# EAGLE design PCB (EAGLE 9.6.2)
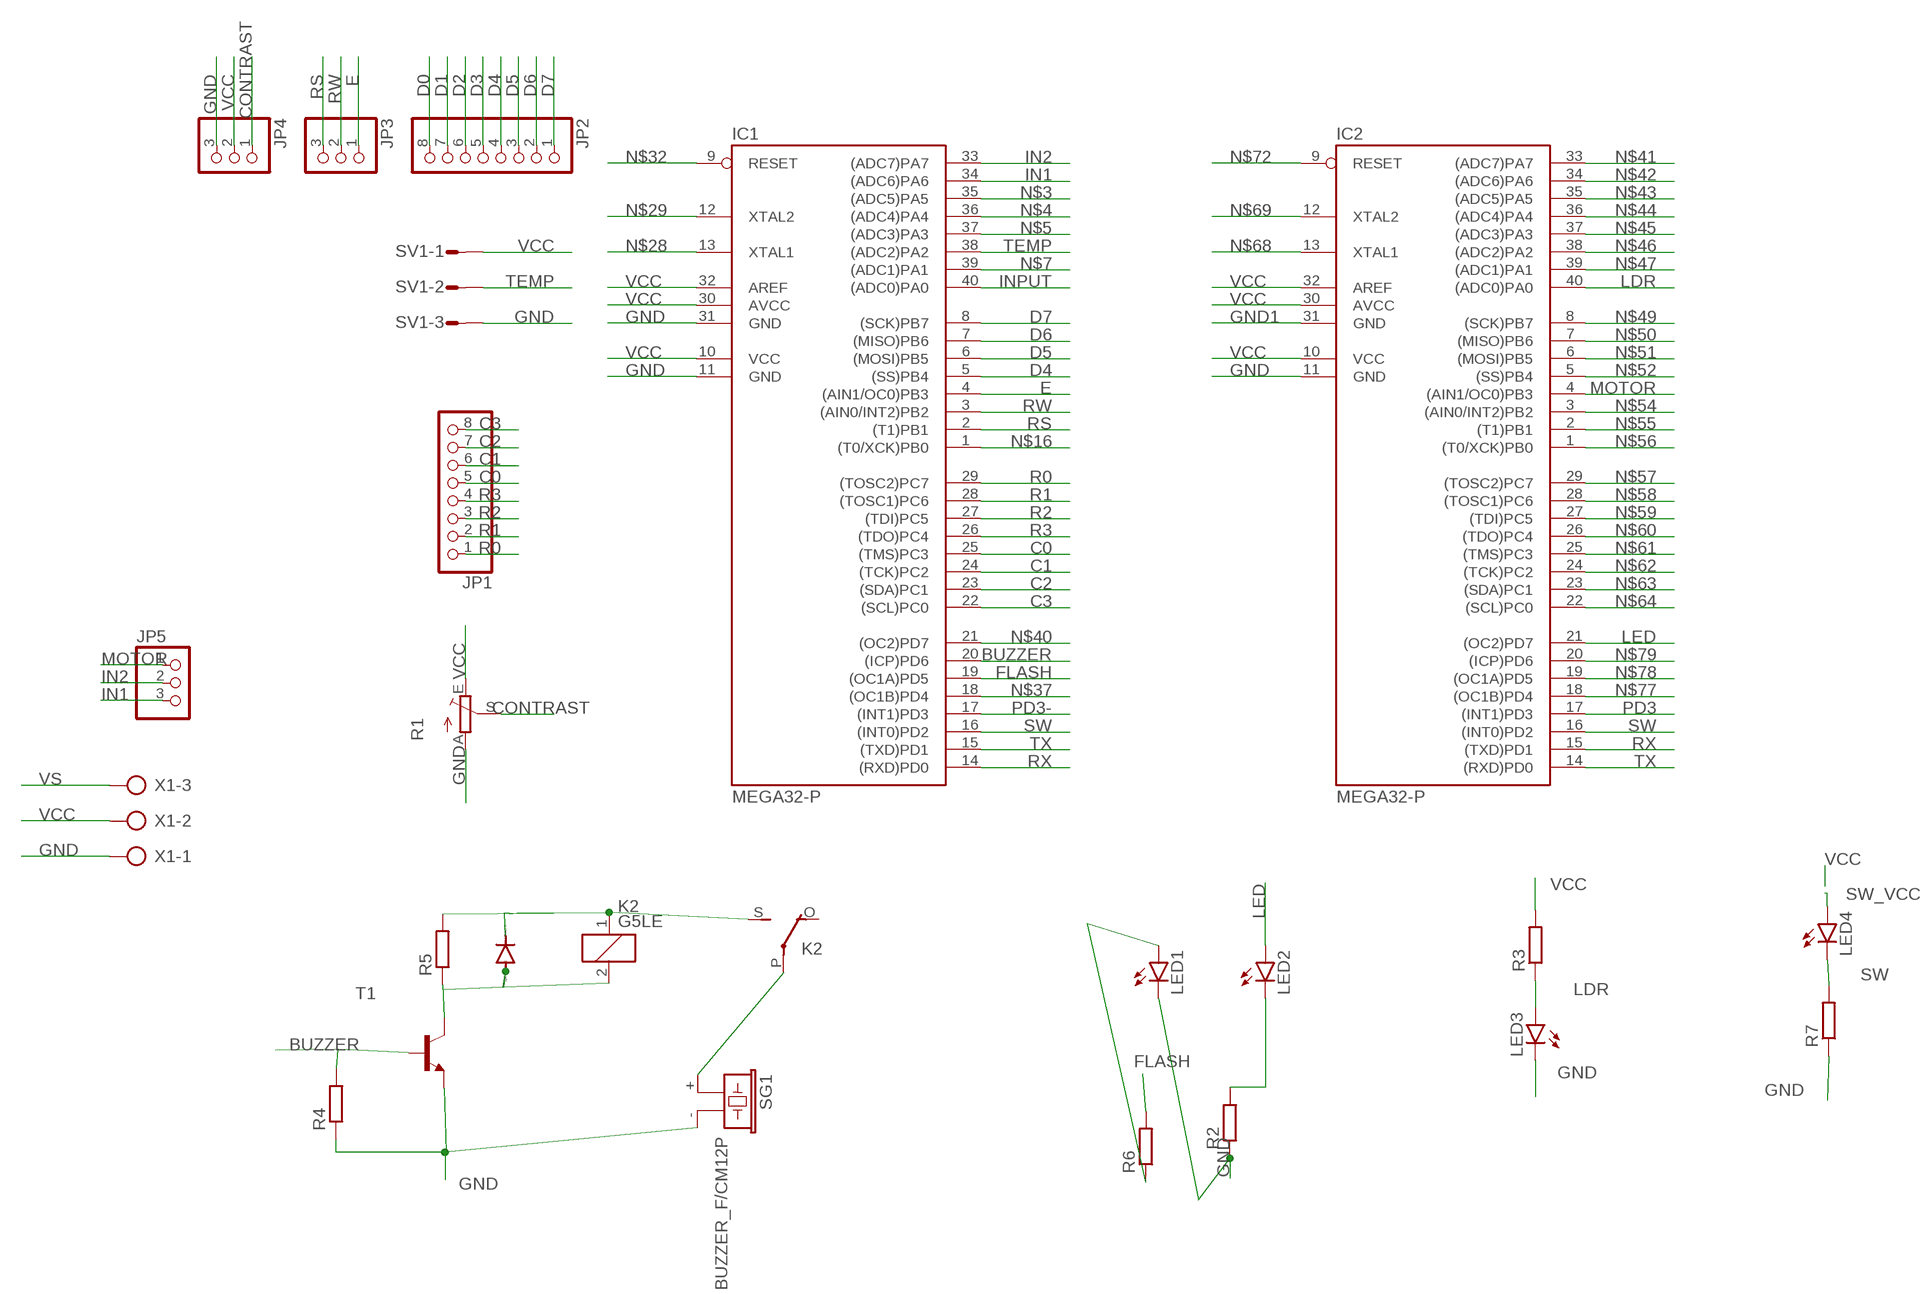
[diagram p0: schematic, sheet 1]

## Parts
D1  1N4004  [DO41-10]
IC1  MEGA32-P  [DIL40]
IC2  MEGA32-P  [DIL40]
JP1  PINHD-1X8  [1X08]
JP2  PINHD-1X8  [1X08]
JP3  PINHD-1X3  [1X03]
JP4  PINHD-1X3  [1X03]
JP5  PINHD-1X3  [1X03]
K2  G5LE  [G5LE]
LED1  LED3MM  [LED3MM]
LED2  LED3MM  [LED3MM]
LED3  LED5MM  [LED5MM]
LED4  LED5MM  [LED5MM]
R1  TRIM_EU-RJ9W  [RJ9W]
R2  R-EU_0204/7  [0204/7]
R3  R-EU_0204/7  [0204/7]
R4  R-EU_0204/7  [0204/7]
R5  R-EU_0204/7  [0204/7]
R6  R-EU_0204/7  [0204/7]
R7  R-EU_0204/7  [0204/7]
SG1  BUZZER_F/CM12P  [BUZZER_F/CM12P]
SV1  CON-AMP-MT_S03P  [CON-AMP-MT_S03P]
T1  2N2222-NPN-TO92-EBC  [TO92-EBC]
X1  AK300/3  [AK300/3]

## Nets
BUZZER: IC1.20((ICP)PD6)
C0: IC1.25((TMS)PC3) JP1.5
C1: IC1.24((TCK)PC2) JP1.6
C2: IC1.23((SDA)PC1) JP1.7
C3: IC1.22((SCL)PC0) JP1.8
CONTRAST: JP4.1 R1.S
D0: JP2.8
D1: JP2.7
D2: JP2.6
D3: JP2.5
D4: IC1.5((SS)PB4) JP2.4
D5: IC1.6((MOSI)PB5) JP2.3
D6: IC1.7((MISO)PB6) JP2.2
D7: IC1.8((SCK)PB7) JP2.1
E: IC1.4((AIN1/OC0)PB3) JP3.1
FLASH: IC1.19((OC1A)PD5) R6.2
GND: IC1.11(GND) IC1.31(GND) IC2.11(GND) JP4.3 LED1.K(C) LED3.K(C) R1.A R2.1 R4.1 R7.1 SG1.- SV1.3 T1.E X1.1
GND1: IC2.31(GND)
IN1: IC1.34((ADC6)PA6) JP5.3
IN2: IC1.33((ADC7)PA7) JP5.2
INPUT: IC1.40((ADC0)PA0)
LDR: IC2.40((ADC0)PA0) LED3.A R3.1
LED: IC2.21((OC2)PD7) LED2.A
MOTOR: IC2.4((AIN1/OC0)PB3) JP5.1
N$2: D1.C K2.1 K2.S(2:S) R5.2
N$3: IC1.35((ADC5)PA5)
N$4: IC1.36((ADC4)PA4)
N$5: IC1.37((ADC3)PA3)
N$6: LED2.K(C) R2.2
N$7: IC1.39((ADC1)PA1)
N$8: LED1.A R6.1
N$9: D1.A K2.2
N$10: R5.1 T1.C
N$11: R4.2 T1.B
N$12: K2.P(2:P) SG1.+
N$16: IC1.1((T0/XCK)PB0)
N$28: IC1.13(XTAL1)
N$29: IC1.12(XTAL2)
N$32: IC1.9(RESET)
N$37: IC1.18((OC1B)PD4)
N$40: IC1.21((OC2)PD7)
N$41: IC2.33((ADC7)PA7)
N$42: IC2.34((ADC6)PA6)
N$43: IC2.35((ADC5)PA5)
N$44: IC2.36((ADC4)PA4)
N$45: IC2.37((ADC3)PA3)
N$46: IC2.38((ADC2)PA2)
N$47: IC2.39((ADC1)PA1)
N$49: IC2.8((SCK)PB7)
N$50: IC2.7((MISO)PB6)
N$51: IC2.6((MOSI)PB5)
N$52: IC2.5((SS)PB4)
N$54: IC2.3((AIN0/INT2)PB2)
N$55: IC2.2((T1)PB1)
N$56: IC2.1((T0/XCK)PB0)
N$57: IC2.29((TOSC2)PC7)
N$58: IC2.28((TOSC1)PC6)
N$59: IC2.27((TDI)PC5)
N$60: IC2.26((TDO)PC4)
N$61: IC2.25((TMS)PC3)
N$62: IC2.24((TCK)PC2)
N$63: IC2.23((SDA)PC1)
N$64: IC2.22((SCL)PC0)
N$68: IC2.13(XTAL1)
N$69: IC2.12(XTAL2)
N$72: IC2.9(RESET)
N$77: IC2.18((OC1B)PD4)
N$78: IC2.19((OC1A)PD5)
N$79: IC2.20((ICP)PD6)
PD3: IC2.17((INT1)PD3)
PD3-: IC1.17((INT1)PD3)
R0: IC1.29((TOSC2)PC7) JP1.1
R1: IC1.28((TOSC1)PC6) JP1.2
R2: IC1.27((TDI)PC5) JP1.3
R3: IC1.26((TDO)PC4) JP1.4
RS: IC1.2((T1)PB1) JP3.3
RW: IC1.3((AIN0/INT2)PB2) JP3.2
RX: IC1.14((RXD)PD0) IC2.15((TXD)PD1)
SW: IC1.16((INT0)PD2) IC2.16((INT0)PD2) LED4.K(C) R7.2
SW_VCC: LED4.A
TEMP: IC1.38((ADC2)PA2) SV1.2
TX: IC1.15((TXD)PD1) IC2.14((RXD)PD0)
VCC: IC1.10(VCC) IC1.30(AVCC) IC1.32(AREF) IC2.10(VCC) IC2.30(AVCC) IC2.32(AREF) JP4.2 R1.E R3.2 SV1.1 X1.2
VS: X1.3
Unconnected: K2.O(2:O)

## Library data of the parts
D1 = diode:1N4004: DIODE general purpose rectifier, 1 A
IC1 IC2 = atmel:MEGA32-P: MICROCONTROLLER 32 Kbytes FLASH 2 Kbytes SRAM 1 Kbytes EEPROM USART 8-channel 10 bit ADC Source: www.atmel.com .. doc2503.pdf; MPN: ATMEGA32-16PU; OC_FARNELL: 1661729; OC_NEWARK: 51P1794
JP1 JP2 = MindCloud:PINHD-1X8: PIN HEADER
JP3-JP5 = MindCloud:PINHD-1X3: PIN HEADER
K2 = relay:G5LE: RELAY 1 x switch, 10 A/120 V AC, 8 A/30 V DC, Omron; OC_FARNELL: unknown; OC_NEWARK: unknown
LED1 LED2 = led:LED: LED OSRAM: - CHIPLED LG R971, LG N971, LY N971, LG Q971, LY Q971, LO R971, LY R971 LH N974, LH R974 LS Q976, LO Q976, LY Q976 LO Q996 - Hyper CHIPLED LW Q18S LB Q993, LB Q99A, LB R99A - SideLED LS A670, LO A670, LY A670, LG A670, LP A670 LB A673, LV A673, LT A673, LW A673 LH A674 LY A675 LS A676, LA A676, LO A676, LY A676, LW A676 LS A679, LY A679, LG A679 - Hyper Micro SIDELED® LS Y876, LA Y876, LO Y876, LY Y876 LT Y87S - SmartLED LW L88C, LW L88S LB L89C, LB L89S, LG L890 LS L89K, LO L89K, LY L89K LS L896, LA L896, LO L896, LY L896 - TOPLED LS T670, LO T670, LY T670, LG T670, LP T670 LSG T670, LSP T670, LSY T670, LOP T670, LYG T670 LG T671, LOG T671, LSG T671 LB T673, LV T673, LT T673, LW T673 LH T674 LS T676, LA T676, LO T676, LY T676, LB T676, LH T676, LSB T676, LW T676 LB T67C, LV T67C, LT T67C, LS T67K, LO T67K, LY T67K, LW E67C LS E67B, LA E67B, LO E67B, LY E67B, LB E67C, LV E67C, LT E67C LW T67C LS T679, LY T679, LG T679 LS T770, LO T770, LY T770, LG T770, LP T770 LB T773, LV T773, LT T773, LW T773 LH T774 LS E675, LA E675, LY E675, LS T675 LS T776, LA T776, LO T776, LY T776, LB T776 LHGB T686 LT T68C, LB T68C - Hyper Mini TOPLED® LB M676 - Mini TOPLED Santana® LG M470 LS M47K, LO M47K, LY M47K Source: http://www.osram.convergy.de LUXEON: - LUMILED® LXK2-PW12-R00, LXK2-PW12-S00, LXK2-PW14-U00, LXK2-PW14-V00 LXK2-PM12-R00, LXK2-PM12-S00, LXK2-PM14-U00 LXK2-PE12-Q00, LXK2-PE12-R00, LXK2-PE12-S00, LXK2-PE14-T00, LXK2-PE14-U00 LXK2-PB12-K00, LXK2-PB12-L00, LXK2-PB12-M00, LXK2-PB14-N00, LXK2-PB14-P00, LXK2-PB14-Q00 LXK2-PR12-L00, LXK2-PR12-M00, LXK2-PR14-Q00, LXK2-PR14-R00 LXK2-PD12-Q00, LXK2-PD12-R00, LXK2-PD12-S00 LXK2-PH12-R00, LXK2-PH12-S00 LXK2-PL12-P00, LXK2-PL12-Q00, LXK2-PL12-R00 Source: www.luxeon.com KINGBRIGHT: KA-3528ASYC Source: www.kingbright.com
LED3 LED4 = Test:LED: LED OSRAM: - CHIPLED LG R971, LG N971, LY N971, LG Q971, LY Q971, LO R971, LY R971 LH N974, LH R974 LS Q976, LO Q976, LY Q976 LO Q996 - Hyper CHIPLED LW Q18S LB Q993, LB Q99A, LB R99A - SideLED LS A670, LO A670, LY A670, LG A670, LP A670 LB A673, LV A673, LT A673, LW A673 LH A674 LY A675 LS A676, LA A676, LO A676, LY A676, LW A676 LS A679, LY A679, LG A679 - Hyper Micro SIDELED® LS Y876, LA Y876, LO Y876, LY Y876 LT Y87S - SmartLED LW L88C, LW L88S LB L89C, LB L89S, LG L890 LS L89K, LO L89K, LY L89K LS L896, LA L896, LO L896, LY L896 - TOPLED LS T670, LO T670, LY T670, LG T670, LP T670 LSG T670, LSP T670, LSY T670, LOP T670, LYG T670 LG T671, LOG T671, LSG T671 LB T673, LV T673, LT T673, LW T673 LH T674 LS T676, LA T676, LO T676, LY T676, LB T676, LH T676, LSB T676, LW T676 LB T67C, LV T67C, LT T67C, LS T67K, LO T67K, LY T67K, LW E67C LS E67B, LA E67B, LO E67B, LY E67B, LB E67C, LV E67C, LT E67C LW T67C LS T679, LY T679, LG T679 LS T770, LO T770, LY T770, LG T770, LP T770 LB T773, LV T773, LT T773, LW T773 LH T774 LS E675, LA E675, LY E675, LS T675 LS T776, LA T776, LO T776, LY T776, LB T776 LHGB T686 LT T68C, LB T68C - Hyper Mini TOPLED® LB M676 - Mini TOPLED Santana® LG M470 LS M47K, LO M47K, LY M47K Source: http://www.osram.convergy.de LUXEON: - LUMILED® LXK2-PW12-R00, LXK2-PW12-S00, LXK2-PW14-U00, LXK2-PW14-V00 LXK2-PM12-R00, LXK2-PM12-S00, LXK2-PM14-U00 LXK2-PE12-Q00, LXK2-PE12-R00, LXK2-PE12-S00, LXK2-PE14-T00, LXK2-PE14-U00 LXK2-PB12-K00, LXK2-PB12-L00, LXK2-PB12-M00, LXK2-PB14-N00, LXK2-PB14-P00, LXK2-PB14-Q00 LXK2-PR12-L00, LXK2-PR12-M00, LXK2-PR14-Q00, LXK2-PR14-R00 LXK2-PD12-Q00, LXK2-PD12-R00, LXK2-PD12-S00 LXK2-PH12-R00, LXK2-PH12-S00 LXK2-PL12-P00, LXK2-PL12-Q00, LXK2-PL12-R00 Source: www.luxeon.com KINGBRIGHT: KA-3528ASYC Source: www.kingbright.com
R1 = pot:TRIM_EU-: POTENTIOMETER
R2-R7 = rcl:R-EU_: RESISTOR, European symbol; SPICEPREFIX: R
SG1 = MindCloud:BUZZER_F/CM12P: BUZZER Source: Buerklin; OC_FARNELL: unknown; OC_NEWARK: unknown
SV1 = MindCloud:CON-AMP-MT_S03P: AMP MT CONNECTOR; OC_FARNELL: unknown; OC_NEWARK: unknown
T1 = transistor-neu-to92:*-NPN-: NPN Transistror
X1 = con-ptr500:AK300/3: CONNECTOR; OC_FARNELL: unknown; OC_NEWARK: unknown

## Board
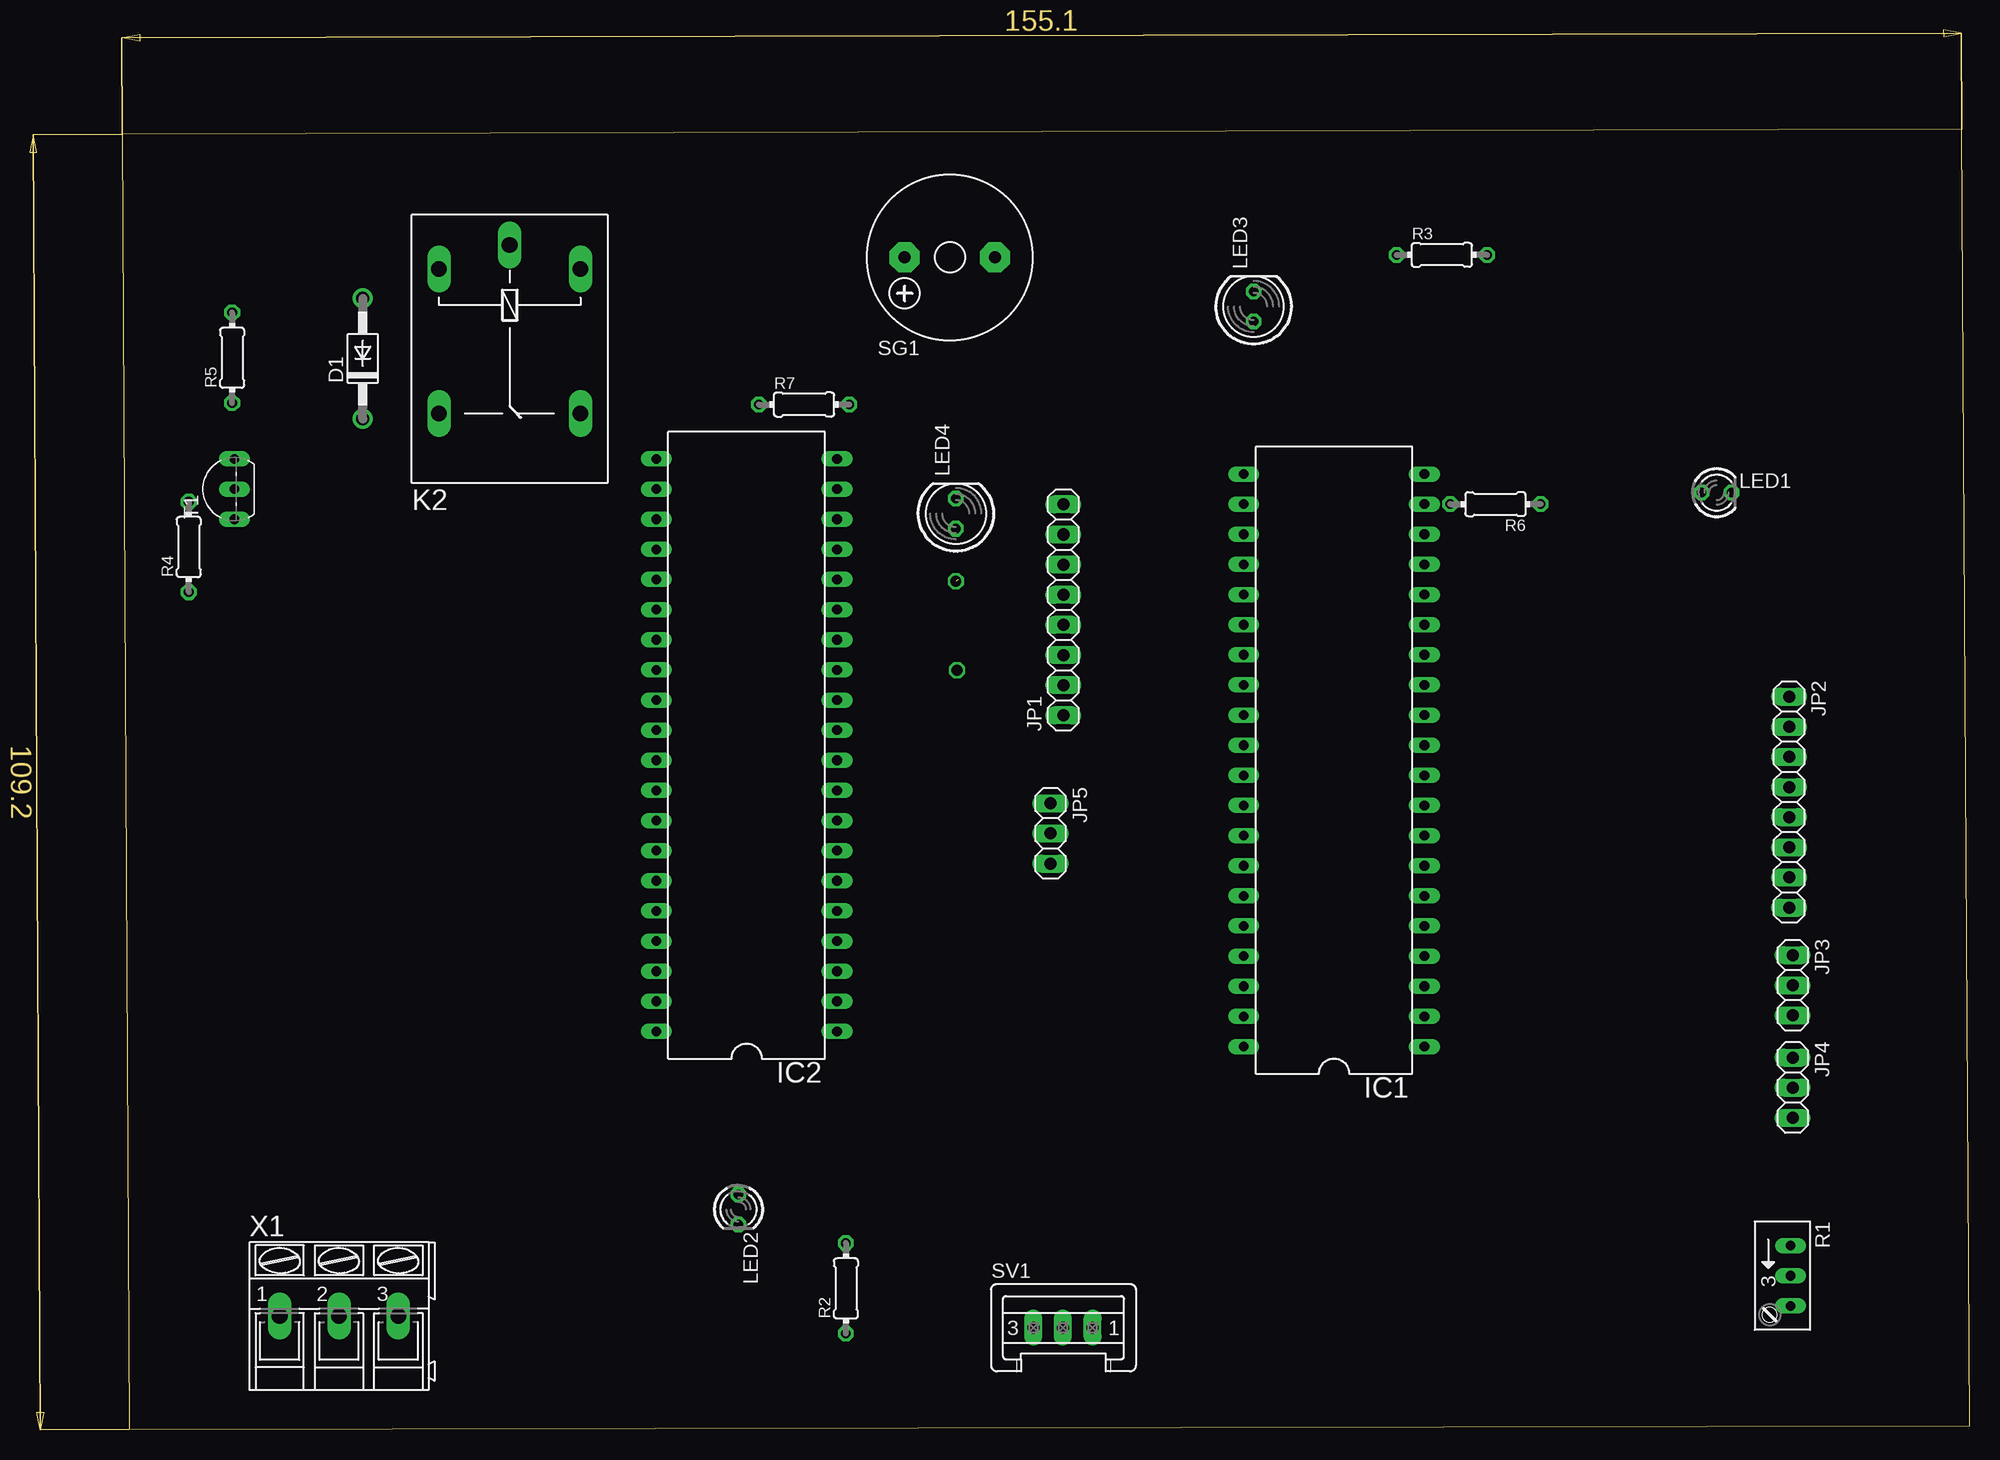
[diagram p1: board, top side]
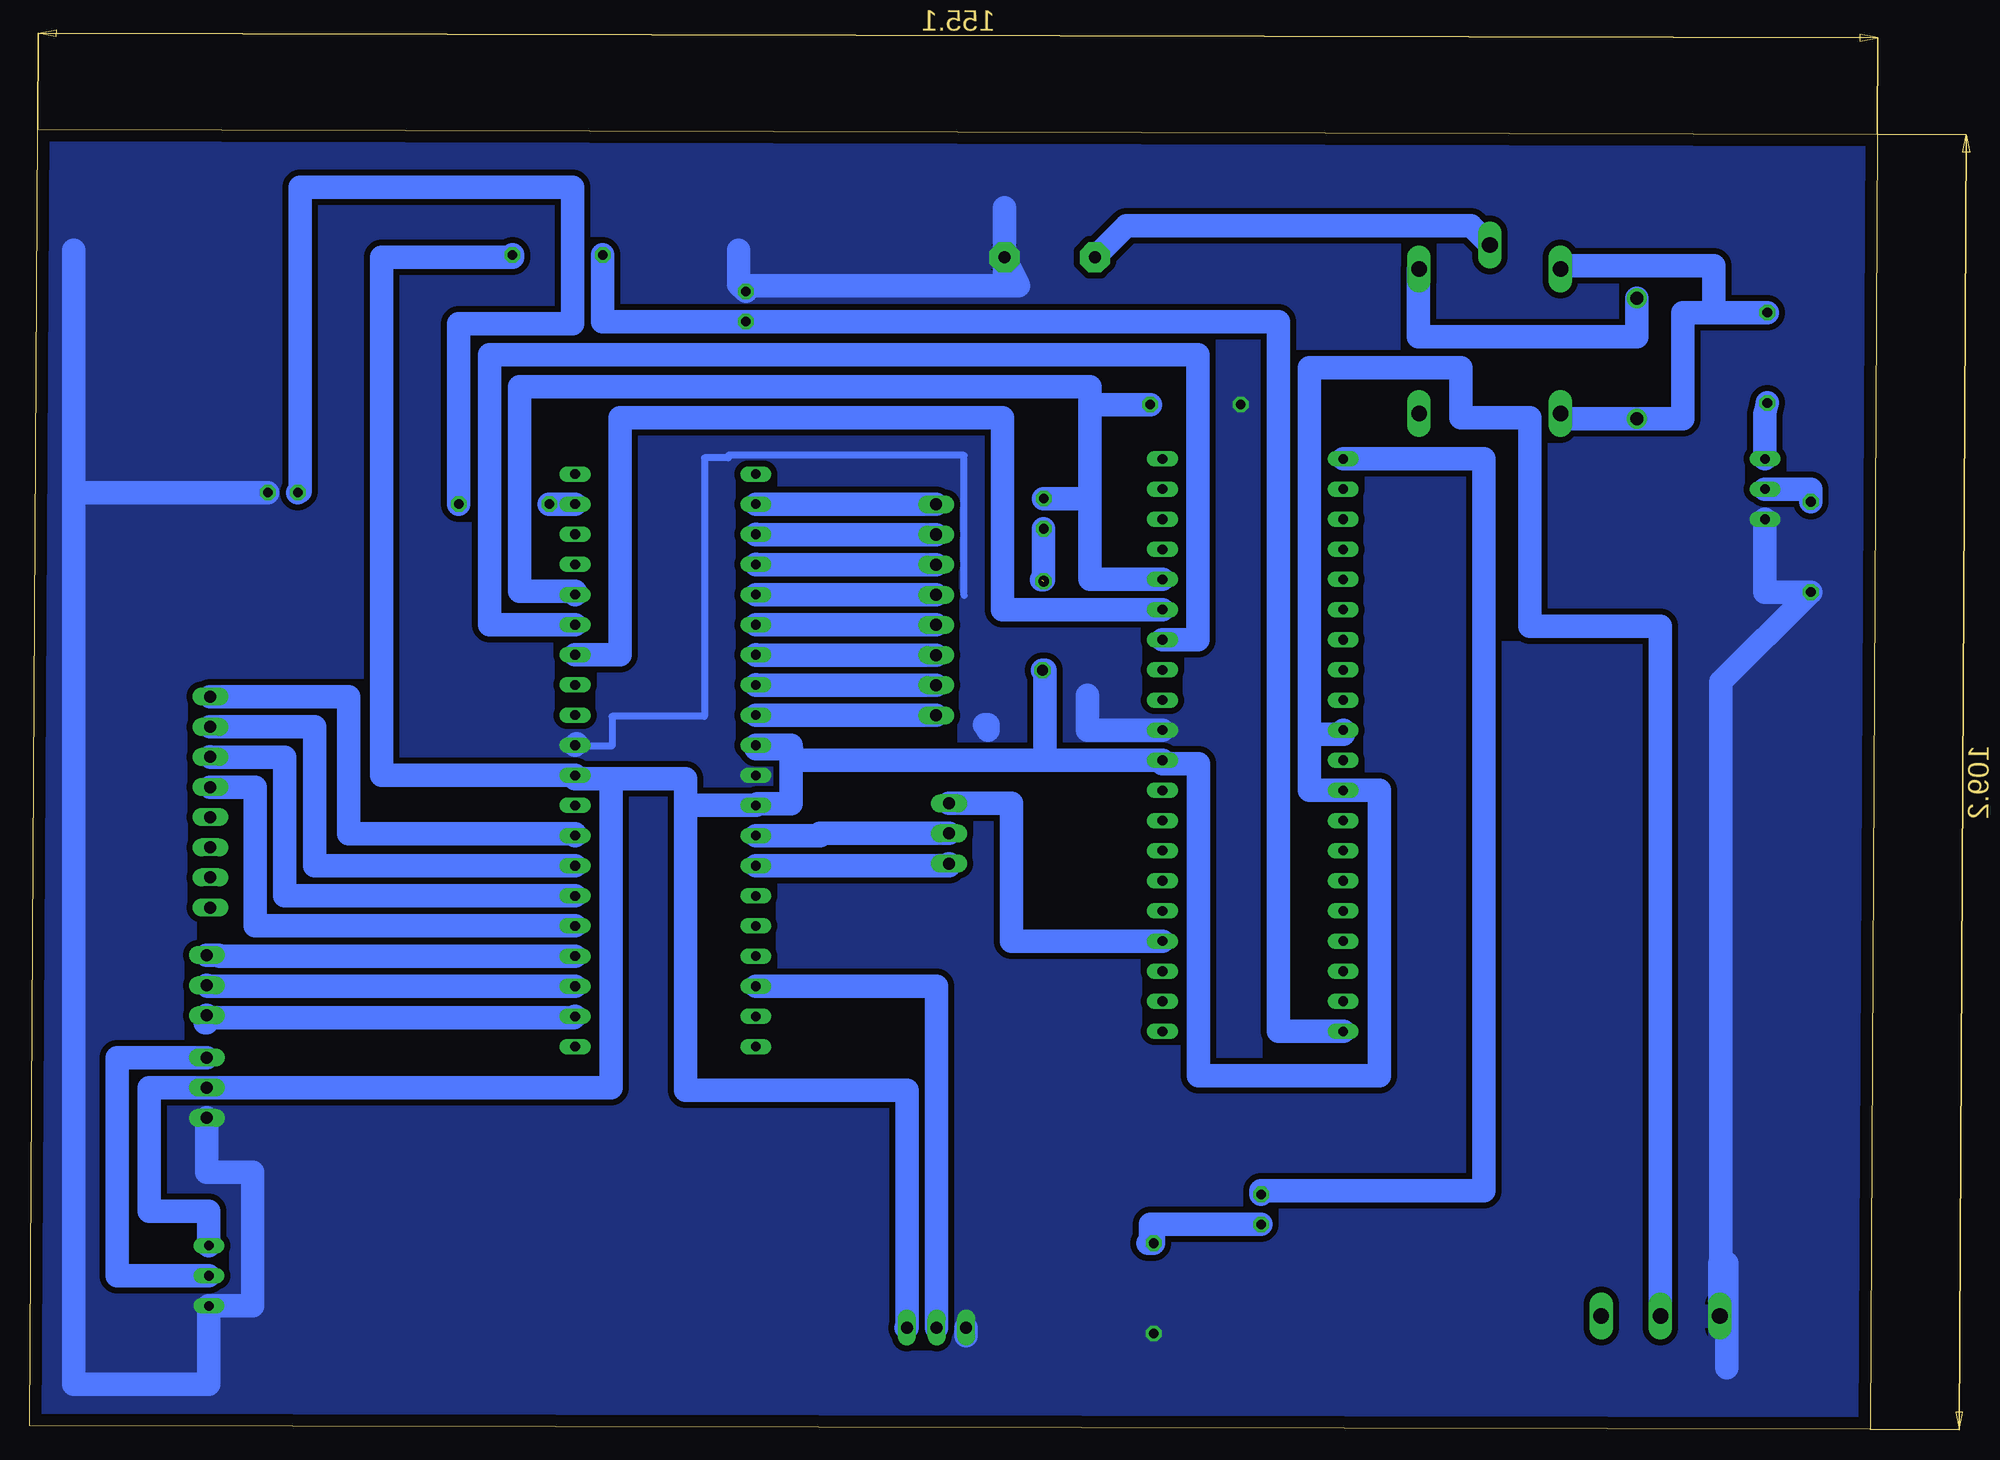
[diagram p2: board, bottom side, seen from below]

Size 155.8 x 109.6 mm. Coordinates in mm from the lower left corner, seen from the top.
Outline: 0.6,0 155.8,0.3 155.1,109.6 0,109.2 0.6,0
Copper layers (1*16): Top 0.035mm / dielectric 1.5mm / Bottom 0.035mm
Design rules "default *": minimum track width 6mil, minimum drill 0.35mm, track to track 0.5mm, track to pad 0.5mm, pad to pad 0.5mm, via to via 6mil, smd to smd 0.5mm, copper to edge 40mil, drill to drill 6mil, minimum pad ring 10mil, minimum via ring 8mil, stop-mask expansion 4mil, vias tented up to drill 0mil, thermal gap 10mil

### Footprints (pad centres in the part's own frame; a part is rotated, then mirrored left to right if it is on the bottom)
DO41-10 = drill 1.118: A 5.08,0; C -5.08,0
DIL40 = drill 0.813 long: 1 -24.13,-7.62; 2 -21.59,-7.62; 3 -19.05,-7.62; 4 -16.51,-7.62; 5 -13.97,-7.62; 6 -11.43,-7.62; 7 -8.89,-7.62; 8 -6.35,-7.62; 9 -3.81,-7.62; 10 -1.27,-7.62; 11 1.27,-7.62; 12 3.81,-7.62; 13 6.35,-7.62; 14 8.89,-7.62; 15 11.43,-7.62; 16 13.97,-7.62; 17 16.51,-7.62; 18 19.05,-7.62; 19 21.59,-7.62; 20 24.13,-7.62; 21 24.13,7.62; 22 21.59,7.62; 23 19.05,7.62; 24 16.51,7.62; 25 13.97,7.62; 26 11.43,7.62; 27 8.89,7.62; 28 6.35,7.62; 29 3.81,7.62; 30 1.27,7.62; 31 -1.27,7.62; 32 -3.81,7.62; 33 -6.35,7.62; 34 -8.89,7.62; 35 -11.43,7.62; 36 -13.97,7.62; 37 -16.51,7.62; 38 -19.05,7.62; 39 -21.59,7.62; 40 -24.13,7.62
1X08 = drill 1.016 long: 1 -8.89,0; 2 -6.35,0; 3 -3.81,0; 4 -1.27,0; 5 1.27,0; 6 3.81,0; 7 6.35,0; 8 8.89,0
1X03 = drill 1.016 long: 1 -2.54,0; 2 0,0; 3 2.54,0
G5LE = drill 1.321 long: 1 -7.493,-5.969; 2 -7.493,5.969; O 4.699,5.969; P -9.525,0; S 4.699,-5.969
LED3MM = drill 0.813 octagon: A -1.27,0; K 1.27,0
LED5MM = drill 0.813 octagon: A -1.27,0; K 1.27,0
RJ9W = drill 0.813 long: A 2.54,0.635; E -2.54,0.635; S 0,0.635
0204/7 = drill 0.813 octagon: 1 -3.81,0; 2 3.81,0
BUZZER_F/CM12P = drill 1.016 pad 2.54 octagon: + 3.81,0; - -3.81,0
CON-AMP-MT_S03P = drill 1.016 long: 1 2.5,0; 2 0,0; 3 -2.5,0
TO92-EBC = drill 0.813 long: B 0,-1.27; C 2.54,-1.27; E -2.54,-1.27
AK300/3 = drill 1.321 long: 1 -5.004,0; 2 0,0; 3 5.004,0

### Placement (x,y rotation side)
D1  20.29,90.27 90 top
IC1  102.19,56.41 90 top
IC2  52.66,57.68 90 top
JP1  79.36,69.09 90 top
JP2  140.56,52.88 270 top
JP3  140.86,37.44 270 top
JP4  140.86,28.81 270 top
JP5  78.28,50.24 270 top
K2  32.68,90.33 270 top
LED1  134.45,78.98 0 top
LED2  51.96,18.55 270 top
LED3  95.41,94.66 90 top
LED4  70.3,77.2 90 top
R1  140.06,12.96 270 top
R2  61.03,11.89 90 top
R3  111.28,99.01 0 top
R4  5.62,74.39 90 top
R5  9.28,90.34 90 top
R6  115.8,78 180 top
R7  57.5,86.4 0 top
SG1  69.79,98.81 180 top
SV1  79.33,8.58 0 top
T1  8.21,79.27 90 top
X1  18.29,9.55 0 top

### Tracks (layer width: path | path; a pad name or v marks a point on that pad's centre or on a via)
C0
  Bottom 2: JP1.5 94.57,70.36 IC1.25
C1
  Bottom 2: JP1.6 94.57,72.9 IC1.24
C2
  Bottom 2: JP1.7 94.57,75.44 IC1.23
C3
  Bottom 2: IC1.22 94.55,77.98 JP1.8
CONTRAST
  Bottom 2: R1.S 148.4,12.96 148.4,31.35 JP4.1
D4
  Bottom 2: JP2.4 140.56,54.13 136.78,54.13 136.78,42.44 IC1.5
D5
  Bottom 2: JP2.3 140.54,56.67 134.28,56.67 134.28,44.98 IC1.6
D6
  Bottom 2: JP2.2 131.75,59.23 131.75,47.52 IC1.7
D7
  Bottom 2: JP2.1 128.9,61.77 128.9,50.2 109.81,50.2 IC1.8
E
  Bottom 2: JP3.1 139.86,39.98 139.78,39.9 IC1.4
FLASH
  Bottom 2: IC1.19 R6.2
GND
  Bottom 0.6: IC1.11 109.81,57.6 106.7,57.6 106.7,60.1 98.9,60.1 98.9,81.9 96.89,81.9 96.89,82.1 77,82.1 77,70.3
  Bottom 2: JP4.3 140.86,21.7 137,21.7 137,10.42 R1.A 140.69,3.82 152.1,3.82 152.1,78.98 | IC1.11 109.7,57.79 | T1.E 9.48,70.58 R4.1 13.19,63.01 13.19,14 | X1.1 13.29,14 13.19,14 | 73.6,96.43 94.91,96.43 LED3.K 96.01,96.53 96.01,99.4 | 73.6,96.43 72.44,96.43 SG1.- | 152.1,99.4 152.1,78.98 | 13.19,14 12.7,14 12.7,5.18 | 73.6,103 73.6,96.43 | 75,58.95 75,59.4 75.28,59.4 | LED1.K 152.1,78.98 | SV1.3 76.83,7.9 | IC2.11 66.6,58.95 66.6,61.9
  pour Bottom: -3.9,110.8 158.3,110.8 158.3,-2.6 -11.7,-2.6 -11.7,109.1 -5.9,109.1 -5.9,108.4 -5.3,108.4 -5.3,110.83
IN1
  Bottom 2: IC1.34 78.28,47.52 JP5.3
IN2
  Bottom 2: JP5.2 89.17,50.24 89.17,50.06 IC1.33
LDR
  Bottom 2: R3.1 107.47,93.39 LED3.A 50.5,93.39 50.5,33.55 IC2.40
LED
  Bottom 2: IC2.21 33.2,81.81 33.2,20.12 51.96,20.12 LED2.A
MOTOR
  Bottom 2: JP5.1 78.27,52.79 73,52.79 73,41.17 IC2.4
N$2
  Bottom 2: R5.2 13.8,94.15 | 13.8,94.15 16.4,94.15 16.4,85.19 D1.C 26.71,85.19 K2.S | 13.8,94.15 13.8,98.1 26.43,98.1 K2.1
N$6
  Bottom 2: 61.5,15.7 61.3,15.7 61.3,17.28 LED2.K 61.03,17.28 R2.2
N$8
  Bottom 2: R6.1 119.61,93.2 110,93.2 110,104.7 133,104.7 133,79.08 133.08,79.08 LED1.A
N$9
  Bottom 2: D1.A 20.29,92.1 38.7,92.1 38.7,97.82 K2.2
N$10
  Bottom 2: T1.C 9.48,85.62 R5.1
N$11
  Bottom 2: R4.2 5.62,79.27 T1.B
N$12
  Bottom 2: SG1.+ 63.33,101.46 34.28,101.46 K2.P
R0
  Bottom 2: JP1.1 94.57,60.2 IC1.29
R1
  Bottom 2: JP1.2 94.57,62.74 IC1.28
R2
  Bottom 2: JP1.3 94.57,65.28 IC1.27
R3
  Bottom 2: JP1.4 94.57,67.82 IC1.26
RS
  Bottom 2: IC1.2 109.93,34.7 138.8,34.7 140.86,34.7 | 140.86,34.86 140.86,34.3 141,34.3 141,34.7 140.86,34.7 | JP3.3 140.86,34.7
RW
  Bottom 2: JP3.2 140.78,37.36 IC1.3
RX
  Bottom 2: IC2.15 73.75,69.11 73.75,85.3 106,85.3 106,65.3 IC1.14
SW
  Bottom 2: LED4.K 66.4,78.47 | 66.4,78.47 66.4,86.4 | 66.4,86.4 66.4,87.9 114.5,87.9 114.5,70.66 109.81,70.66 IC1.16 | IC2.16 66.4,71.65 66.4,78.47 | 66.4,86.4 R7.2
SW_VCC  (via drill 0.9)  (1 unrouted)
  Bottom 2: LED4.A 70.3,71.61 70.5,71.61
  other vias: 70.3,71.5
TEMP
  Bottom 2: IC1.38 79.33,37.36 SV1.2
TX
  Bottom 2: IC1.15 117,67.84 117,90.6 57.3,90.6 57.3,66.57 IC2.14
VCC  (via drill 0.9)
  Bottom 2: R1.E 140.69,18.4 145.7,18.4 145.7,28.81 JP4.2 106.79,28.81 106.79,54.86 | R3.2 115.09,98.81 126.1,98.81 126.1,55.14 IC1.10 109.81,54.86 106.79,54.86 | X1.2 18.29,67.7 29.3,67.7 29.3,85.3 35.1,85.3 35.1,89.5 47.9,89.5 47.9,58.6 | 100.5,52.6 100.5,28.61 81.83,28.61 SV1.1 81.9,8.58 | 47.9,58.6 45.04,58.6 IC2.30 | 47.9,58.6 47.9,53.87 IC2.32 42,53.87 42,29.8 57.26,29.8 57.26,56.13 60.28,56.13 IC2.10 70.2,56.41 | 100.5,52.6 IC1.32 94.43,52.74 91.6,52.74 91.6,57.68 IC1.30 94.57,57.4 91.55,57.4 91.55,56.41 | 91.55,56.41 70.2,56.41 | 91.55,56.41 91.55,56.1 | 106.79,54.86 100.5,54.86 100.5,52.6 | 70.2,56.41 70.2,64 v70.4,64